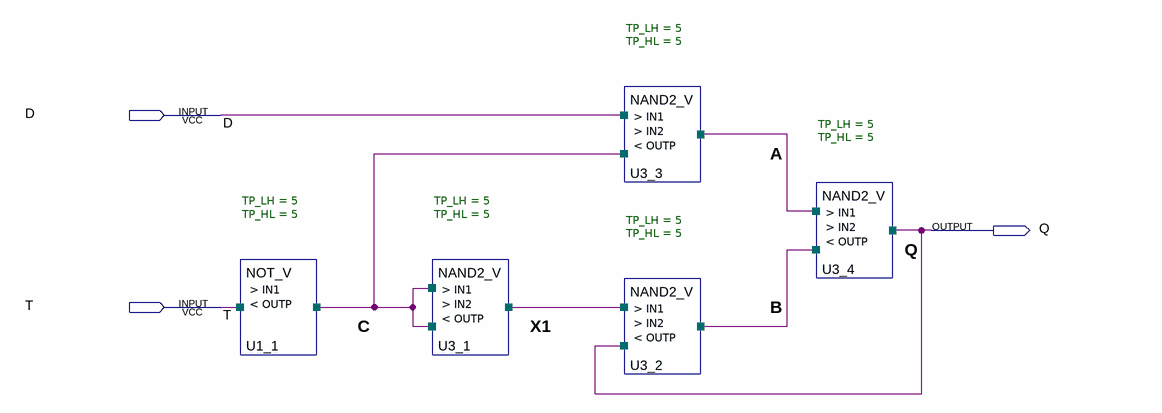
[diagram p0: schematic sheet]
// Quartus schematic ZVH_250_Haz.bdf as structural Verilog: 5 symbols, 3 pins
module ZVH_250_Haz (
  input  D,
  input  T,
  output Q
);

  wire A, B, C, X1;

  NOT_V #(.TP_LH(5), .TP_HL(5)) U1_1 (.IN1(T), .OUTP(C));
  NAND2_V #(.TP_LH(5), .TP_HL(5)) U3_1 (.IN1(C), .IN2(C), .OUTP(X1));
  NAND2_V #(.TP_LH(5), .TP_HL(5)) U3_3 (.IN1(D), .IN2(C), .OUTP(A));
  NAND2_V #(.TP_LH(5), .TP_HL(5)) U3_2 (.IN1(X1), .IN2(Q), .OUTP(B));
  NAND2_V #(.TP_LH(5), .TP_HL(5)) U3_4 (.IN1(A), .IN2(B), .OUTP(Q));
endmodule
